# EAGLE schematic mainboard (EAGLE 9.2.2)
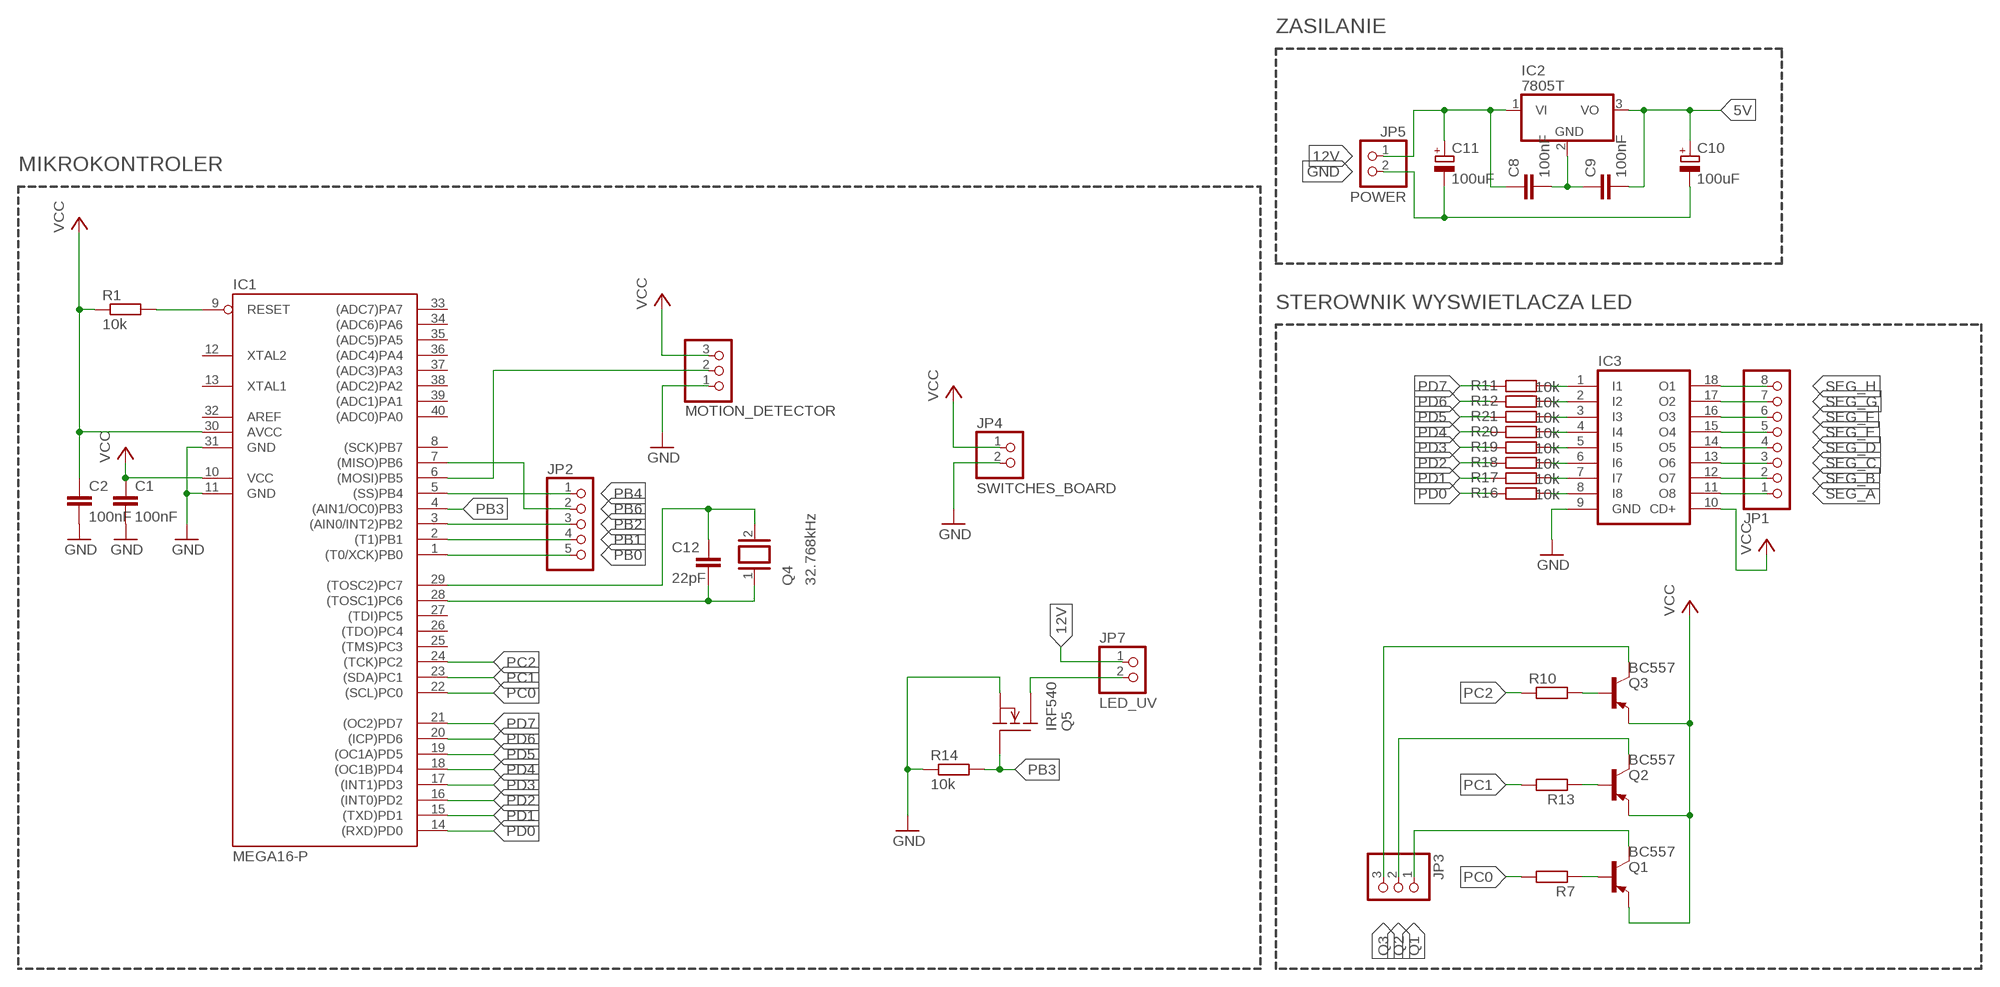
[diagram p0: schematic, sheet 1]

## Parts
C1  100nF  C-EU050-030X075  [C050-030X075]
C2  100nF  C-EU050-030X075  [C050-030X075]
C8  100nF  C-EU050-024X044  [C050-024X044]
C9  100nF  C-EU050-024X044  [C050-024X044]
C10  100uF  CPOL-EUE2.5-6  [E2,5-6]
C11  100uF  CPOL-EUE2.5-6  [E2,5-6]
C12  22pF  C-EU050-030X075  [C050-030X075]
IC1  MEGA16-P  [DIL40]
IC2  7805T  [TO220H]
IC3  ULN2803A  [DIL18]
JP1  PINHD-1X8  [1X08]
JP2  PINHD-1X5  [1X05]
JP3  PINHD-1X3  [1X03]
JP4  SWITCHES_BOARD  PINHD-1X2  [1X02]
JP5  POWER  PINHD-1X2  [1X02]
JP7  LED_UV  PINHD-1X2  [1X02]
MOTION_DETECTOR  PINHD-1X3  [1X03]
Q1  BC557  [TO92-EBC]
Q2  BC557  [TO92-EBC]
Q3  BC557  [TO92-EBC]
Q4  32.768kHz  XTAL  [Q]
Q5  IRF540  [TO220]
R1  10k  R-EU_0204/7  [0204/7]
R7  R-EU_0204/7  [0204/7]
R10  R-EU_0204/7  [0204/7]
R11  10k  R-EU_0204/7  [0204/7]
R12  10k  R-EU_0204/7  [0204/7]
R13  R-EU_0204/7  [0204/7]
R14  10k  R-EU_0204/7  [0204/7]
R16  10k  R-EU_0204/7  [0204/7]
R17  10k  R-EU_0204/7  [0204/7]
R18  10k  R-EU_0204/7  [0204/7]
R19  10k  R-EU_0204/7  [0204/7]
R20  10k  R-EU_0204/7  [0204/7]
R21  10k  R-EU_0204/7  [0204/7]

## Nets
5V: C1.1 C2.1 C9.2 C10.+ IC1.10(VCC) IC1.30(AVCC) IC2.3(VO) Q1.E Q2.E Q3.E R1.1 ; supply symbol labelled VCC
12V: C8.1 C11.+ IC2.1(VI) JP5.1 JP7.1
GND: C1.2 C2.2 C10.- C11.- IC1.11(GND) IC1.31(GND) IC3.9(GND) JP4.2 JP5.2 MOTION_DETECTOR.1 Q5.3(S) R14.1
LED_UV_1: JP7.2 Q5.2(D)
N$1: IC1.9(RESET) R1.2
N$2: IC3.1(I1) R11.1
N$3: C8.2 C9.1 IC2.2(GND)
N$4: IC3.2(I2) R12.1
N$5: IC3.3(I3) R21.1
N$6: Q1.B R7.1
N$7: IC3.4(I4) R20.1
N$8: IC3.5(I5) R19.1
N$9: Q2.B R13.1
N$10: IC3.6(I6) R18.1
N$11: IC3.7(I7) R17.1
N$12: IC3.8(I8) R16.1
N$31: IC1.6((MOSI)PB5) MOTION_DETECTOR.2
N$46: Q3.B R10.2
N$55: C12.1 IC1.29((TOSC2)PC7) Q4.2
N$56: C12.2 IC1.28((TOSC1)PC6) Q4.1
PB0: IC1.1((T0/XCK)PB0) JP2.5
PB1: IC1.2((T1)PB1) JP2.4
PB2: IC1.3((AIN0/INT2)PB2) JP2.3
PB3: IC1.4((AIN1/OC0)PB3) Q5.1(G) R14.2
PB4: IC1.5((SS)PB4) JP2.1
PB6: IC1.7((MISO)PB6) JP2.2
PC0: IC1.22((SCL)PC0) R7.2
PC1: IC1.23((SDA)PC1) R13.2
PC2: IC1.24((TCK)PC2) R10.1
PD0: IC1.14((RXD)PD0) R16.2
PD1: IC1.15((TXD)PD1) R17.2
PD2: IC1.16((INT0)PD2) R18.2
PD3: IC1.17((INT1)PD3) R19.2
PD4: IC1.18((OC1B)PD4) R20.2
PD5: IC1.19((OC1A)PD5) R21.2
PD6: IC1.20((ICP)PD6) R12.2
PD7: IC1.21((OC2)PD7) R11.2
Q1: JP3.1 Q1.C
Q2: JP3.2 Q2.C
Q3: JP3.3 Q3.C
SEG_A: IC3.11(O8) JP1.1
SEG_B: IC3.12(O7) JP1.2
SEG_C: IC3.13(O6) JP1.3
SEG_D: IC3.14(O5) JP1.4
SEG_E: IC3.15(O4) JP1.5
SEG_F: IC3.16(O3) JP1.6
SEG_G: IC3.17(O2) JP1.7
SEG_H: IC3.18(O1) JP1.8
VCC: IC3.10(CD+) JP4.1 MOTION_DETECTOR.3
Unconnected: IC1.8((SCK)PB7) IC1.12(XTAL2) IC1.13(XTAL1) IC1.25((TMS)PC3) IC1.26((TDO)PC4) IC1.27((TDI)PC5) IC1.32(AREF) IC1.33((ADC7)PA7) IC1.34((ADC6)PA6) IC1.35((ADC5)PA5) IC1.36((ADC4)PA4) IC1.37((ADC3)PA3) IC1.38((ADC2)PA2) IC1.39((ADC1)PA1) IC1.40((ADC0)PA0)

## Notes on the sheet
- ZASILANIE
- MIKROKONTROLER
- STEROWNIK WYSWIETLACZA LED

## Library data of the parts
C1 C2 C8 C9 C12 = rcl:C-EU: CAPACITOR, European symbol
C10 C11 = rcl:CPOL-EU: POLARIZED CAPACITOR, European symbol
IC1 = atmel:MEGA16-P: MICROCONTROLLER 16 Kbytes FLASH 1 kbytes SRAM 512 bytes EEPROM USART 8-channel 10 bit ADC Source: avr.lbr; MPN: ATMEGA16-16PU; OC_FARNELL: 9171142; OC_NEWARK: 01M6885
IC2 = linear:78*: Positive VOLTAGE REGULATOR Source: http://cache.national.com/ds/LM/LM78L05.pdf http://www.fairchildsemi.com/ds/LM/LM7805.pdf
IC3 = uln-udn:ULN2803A: DRIVER ARRAY
JP1 = pinhead:PINHD-1X8: PIN HEADER
JP2 = pinhead:PINHD-1X5: PIN HEADER
JP3 MOTION_DETECTOR = pinhead:PINHD-1X3: PIN HEADER
JP4 JP5 JP7 = pinhead:PINHD-1X2: PIN HEADER
Q1-Q3 = transistor-pnp:BC557*: PNP Transistror
Q4 = special:XTAL: CRYSTAL
Q5 = transistor-fet:IRF540: N-Channel Enhancement MOSFET (HEXFET); 100V; 28A; 0,077Ohm
R1 R7 R10-R14 R16-R21 = rcl:R-EU_: RESISTOR, European symbol